# Altium schematic sheet Reefing-Radio_MCU.SchDoc: Reefing System
size A4; DocumentNumber: Subtitle; Revision: V1.0; SheetNumber: 7; SheetTotal: 13; Author: Luca Jost; Subtitle: Radio MCU
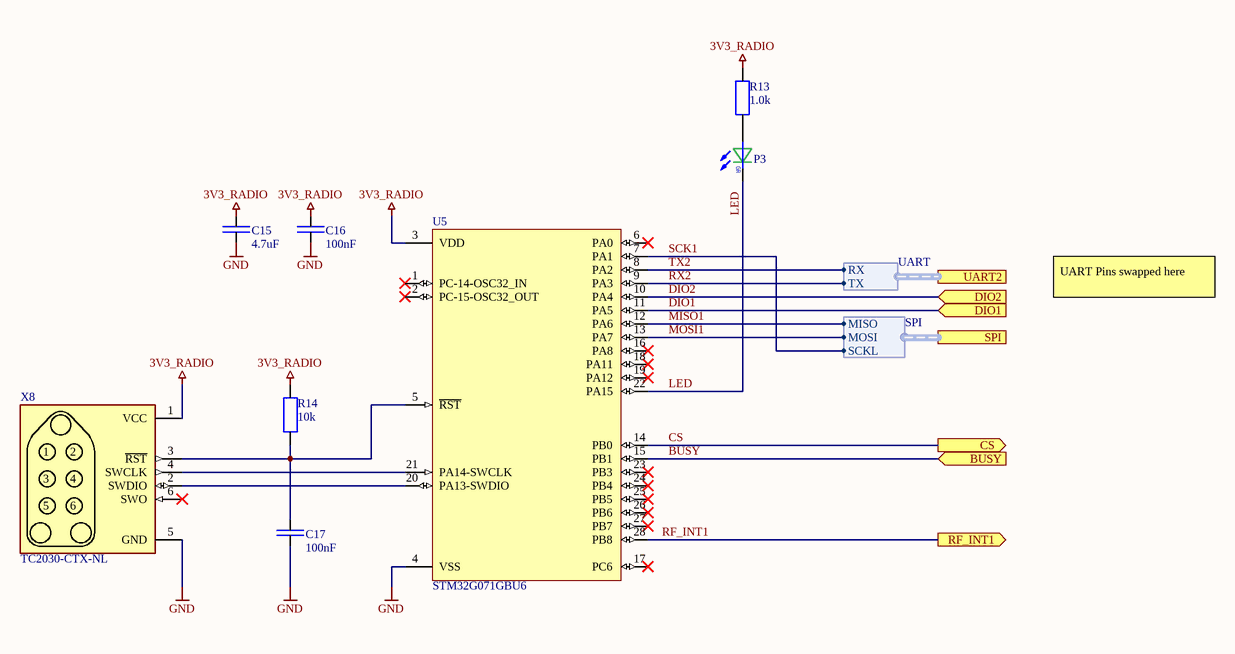
[diagram p0: Reefing-Radio_MCU.SchDoc]

## Parts
C15  4.7uF  [SMD Keramikkondensator 0402]
C16  100nF  [SMD Keramikkondensator 0402]
C17  100nF  [SMD Keramikkondensator 0402]
P3  LED  [SMD LED 0603]  (value not drawn)
R13  1.0k  [SMD Widerstand 0402]
R14  10k  [SMD Widerstand 0402]
U5  STM32G071GBU6  [SMD IC QFN-28 4x4 0.5 Pitch]
X8  TC2030-CTX-NL  [SMD Connector TC2030]  (no BOM)

## Ports
BUSY (in), CS (out), DIO1 (in), DIO2 (in), RF_INT1 (out), SPI (harness SPI), UART2 (harness UART)

## Harnesses
SPI: SCKL, MOSI, MISO
UART: RX, TX

## Nets
3V3_RADIO: C15.2 C16.2 R13.2 R14.2 U5.3(VDD) X8.1(VCC)
GND: C15.1 C16.1 C17.1 U5.4(VSS) X8.5(GND)
BUSY: U5.15(PB1) ; port BUSY
CS: U5.14(PB0) ; port CS
DIO1: U5.11(PA5) ; port DIO1
DIO2: U5.10(PA4) ; port DIO2
LED: P3.K U5.22(PA15)
MISO1: U5.12(PA6) ; port SPI.MISO
MOSI1: U5.13(PA7) ; port SPI.MOSI
RF_INT1: U5.28(PB8) ; port RF_INT1
RX2: U5.9(PA3) ; port UART2.TX
SCK1: U5.7(PA1) ; port SPI.SCKL
TX2: U5.8(PA2) ; port UART2.RX
NetC17_2: C17.2 R14.1 U5.5(~{RST}) X8.3(~{RST})
NetP3_A: P3.A R13.1
NetU5_20: U5.20(PA13-SWDIO) X8.2(SWDIO)
NetU5_21: U5.21(PA14-SWCLK) X8.4(SWCLK)

Not connected (* = marked no-connect by the designer): U5 1(PC-14-OSC32_IN)* 2(PC-15-OSC32_OUT)* 6(PA0)* 16(PA8)* 17(PC6)* 18(PA11)* 19(PA12)* 23(PB3)* 24(PB4)* 25(PB5)* 26(PB6)* 27(PB7)*; X8 6(SWO)*

## Notes on the sheet
- UART Pins swapped here
- Title
- Author:
- Subtitle
- Date:
- Rev:
- File:
- Sheet
- of
- (in symbol LED) GR

## Library data of the parts
C15 = E6 - 4.7uF: SMD Ceramic Capacitor E6; Unit Price: 0.01; JLC: C23733
C16 C17 = E6 - 100nF: SMD Ceramic Capacitor E6; Unit Price: 0.01; JLC: C307331
P3 = LED: Color LED; JLC: C72043
R13 = E24 - 1.0k: SMD Chip Resistor E24; Unit Price: 0.01; JLC: C11702
R14 = E24 - 10k: SMD Chip Resistor E24; Unit Price: 0.01; JLC: C25744
U5 = STM32G071GBU6: ARM® Cortex®-M0+ series Microcontroller IC 32-Bit 64MHz 128KB (128K x 8) FLASH 28-UFQFPN (4x4); Digikey: 497-18343-ND; JLC: C529347; ComponentLink1Description: Datasheet; ComponentLink1URL: https://media.digikey.com/pdf/Data%20Sheets/ST%20Microelectronics%20PDFS/STM32G071_Rev1_DS.pdf; Unit Price: 4.07
X8 = TC2030-CTX-NL: Tag-Connect for ARM-Cortex (6-Pin); Unit Price: 0.00